# Altium schematic sheet Ethernet Connector.SchDoc
size 209 x 297 mm; Author: ALTIUM GOSTBOM2.0 KEV; SheetNumber: 13; SheetTotal: 48
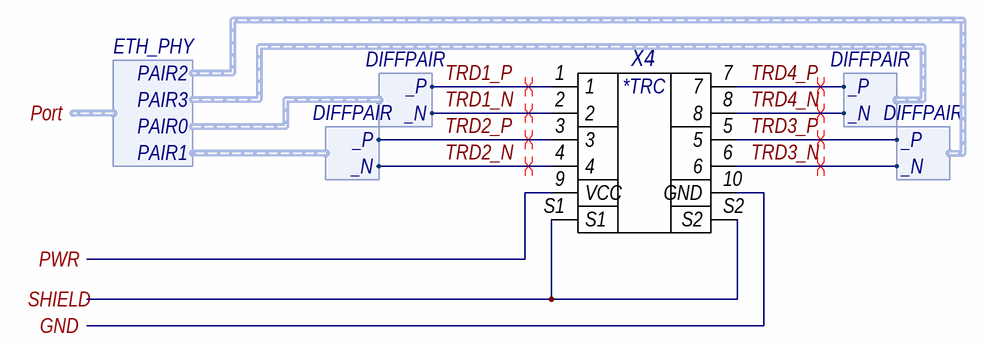
[diagram p0: Ethernet Connector.SchDoc]

## Parts
X4  7499111001A  [WE-7499111001A_V]  (value not drawn)

## Ports
GND, Port (harness ETH_PHY), PWR, SHIELD

## Harnesses
ETH_PHY: PAIR0, PAIR1, PAIR2, PAIR3
DIFFPAIR: _P, _N

## Nets
GND: X4.10(GND) ; port GND
PWR: X4.9(VCC) ; port PWR
SHIELD: X4.S1 X4.S2 ; port SHIELD
TRD1_N: X4.2 ; harness DIFFPAIR._N
TRD1_P: X4.1 ; harness DIFFPAIR._P
TRD2_N: X4.4 ; harness DIFFPAIR._N
TRD2_P: X4.3 ; harness DIFFPAIR._P
TRD3_N: X4.6 ; harness DIFFPAIR._N
TRD3_P: X4.5 ; harness DIFFPAIR._P
TRD4_N: X4.8 ; harness DIFFPAIR._N
TRD4_P: X4.7 ; harness DIFFPAIR._P

## Layout directives
differential pair: TRD1_N, TRD1_P, TRD2_N, TRD2_P, TRD3_N, TRD3_P, TRD4_N, TRD4_P

## Notes on the sheet
- Подп. дата
- Инв. № дубл.
- Взам. инв. №
- Подп. и дата
- Инв. № подл.
- Изм.
- Лист
- № докум.
- Подп.
- Дата
- Файл:
- ALTIUM GOSTBOM2.0 KEV
- Копировал
- Формат А4
- (in symbol E37) *TRC

## Library data of the parts
X4 = E37: RJ45 LAN Transformer, Modular JACK, 0 to 70 degC, 10-Pin THD, RoHS, Tube; Тип элемента: Набор трансформаторов; UID: E37; Component Kind: Standard; ComponentLink1Description: Manufacturer URL; ComponentLink1URL: https://www.we-online.com/; ComponentLink2Description: Datasheet; ComponentLink2URL: https://katalog.we-online.de/pbs/datasheet/7499111001A.pdf; DatasheetVersion: Rev. 01; Mounting Technology: Through Hole; PackageDescription: 10-Pin Through Hole Device, Body 21.84 x 16 mm; PartNumber: 7499111001A; RoHSCompliant: False; ClassName: AB19, AB20, AC12